# EasyEDA Pro project OpenTenkiEasyEda.eprj

# Schematic Schematic1_1
Board Name: OpenTenki; Create Date: 2025-09-28; Page Name: P1; Project Name: WetherBudy_r; Schematic Name: Schematic1_1; Update Date: 2026-03-23; Company: EasyEDA.com; Page Size: A4; Version: V1.0
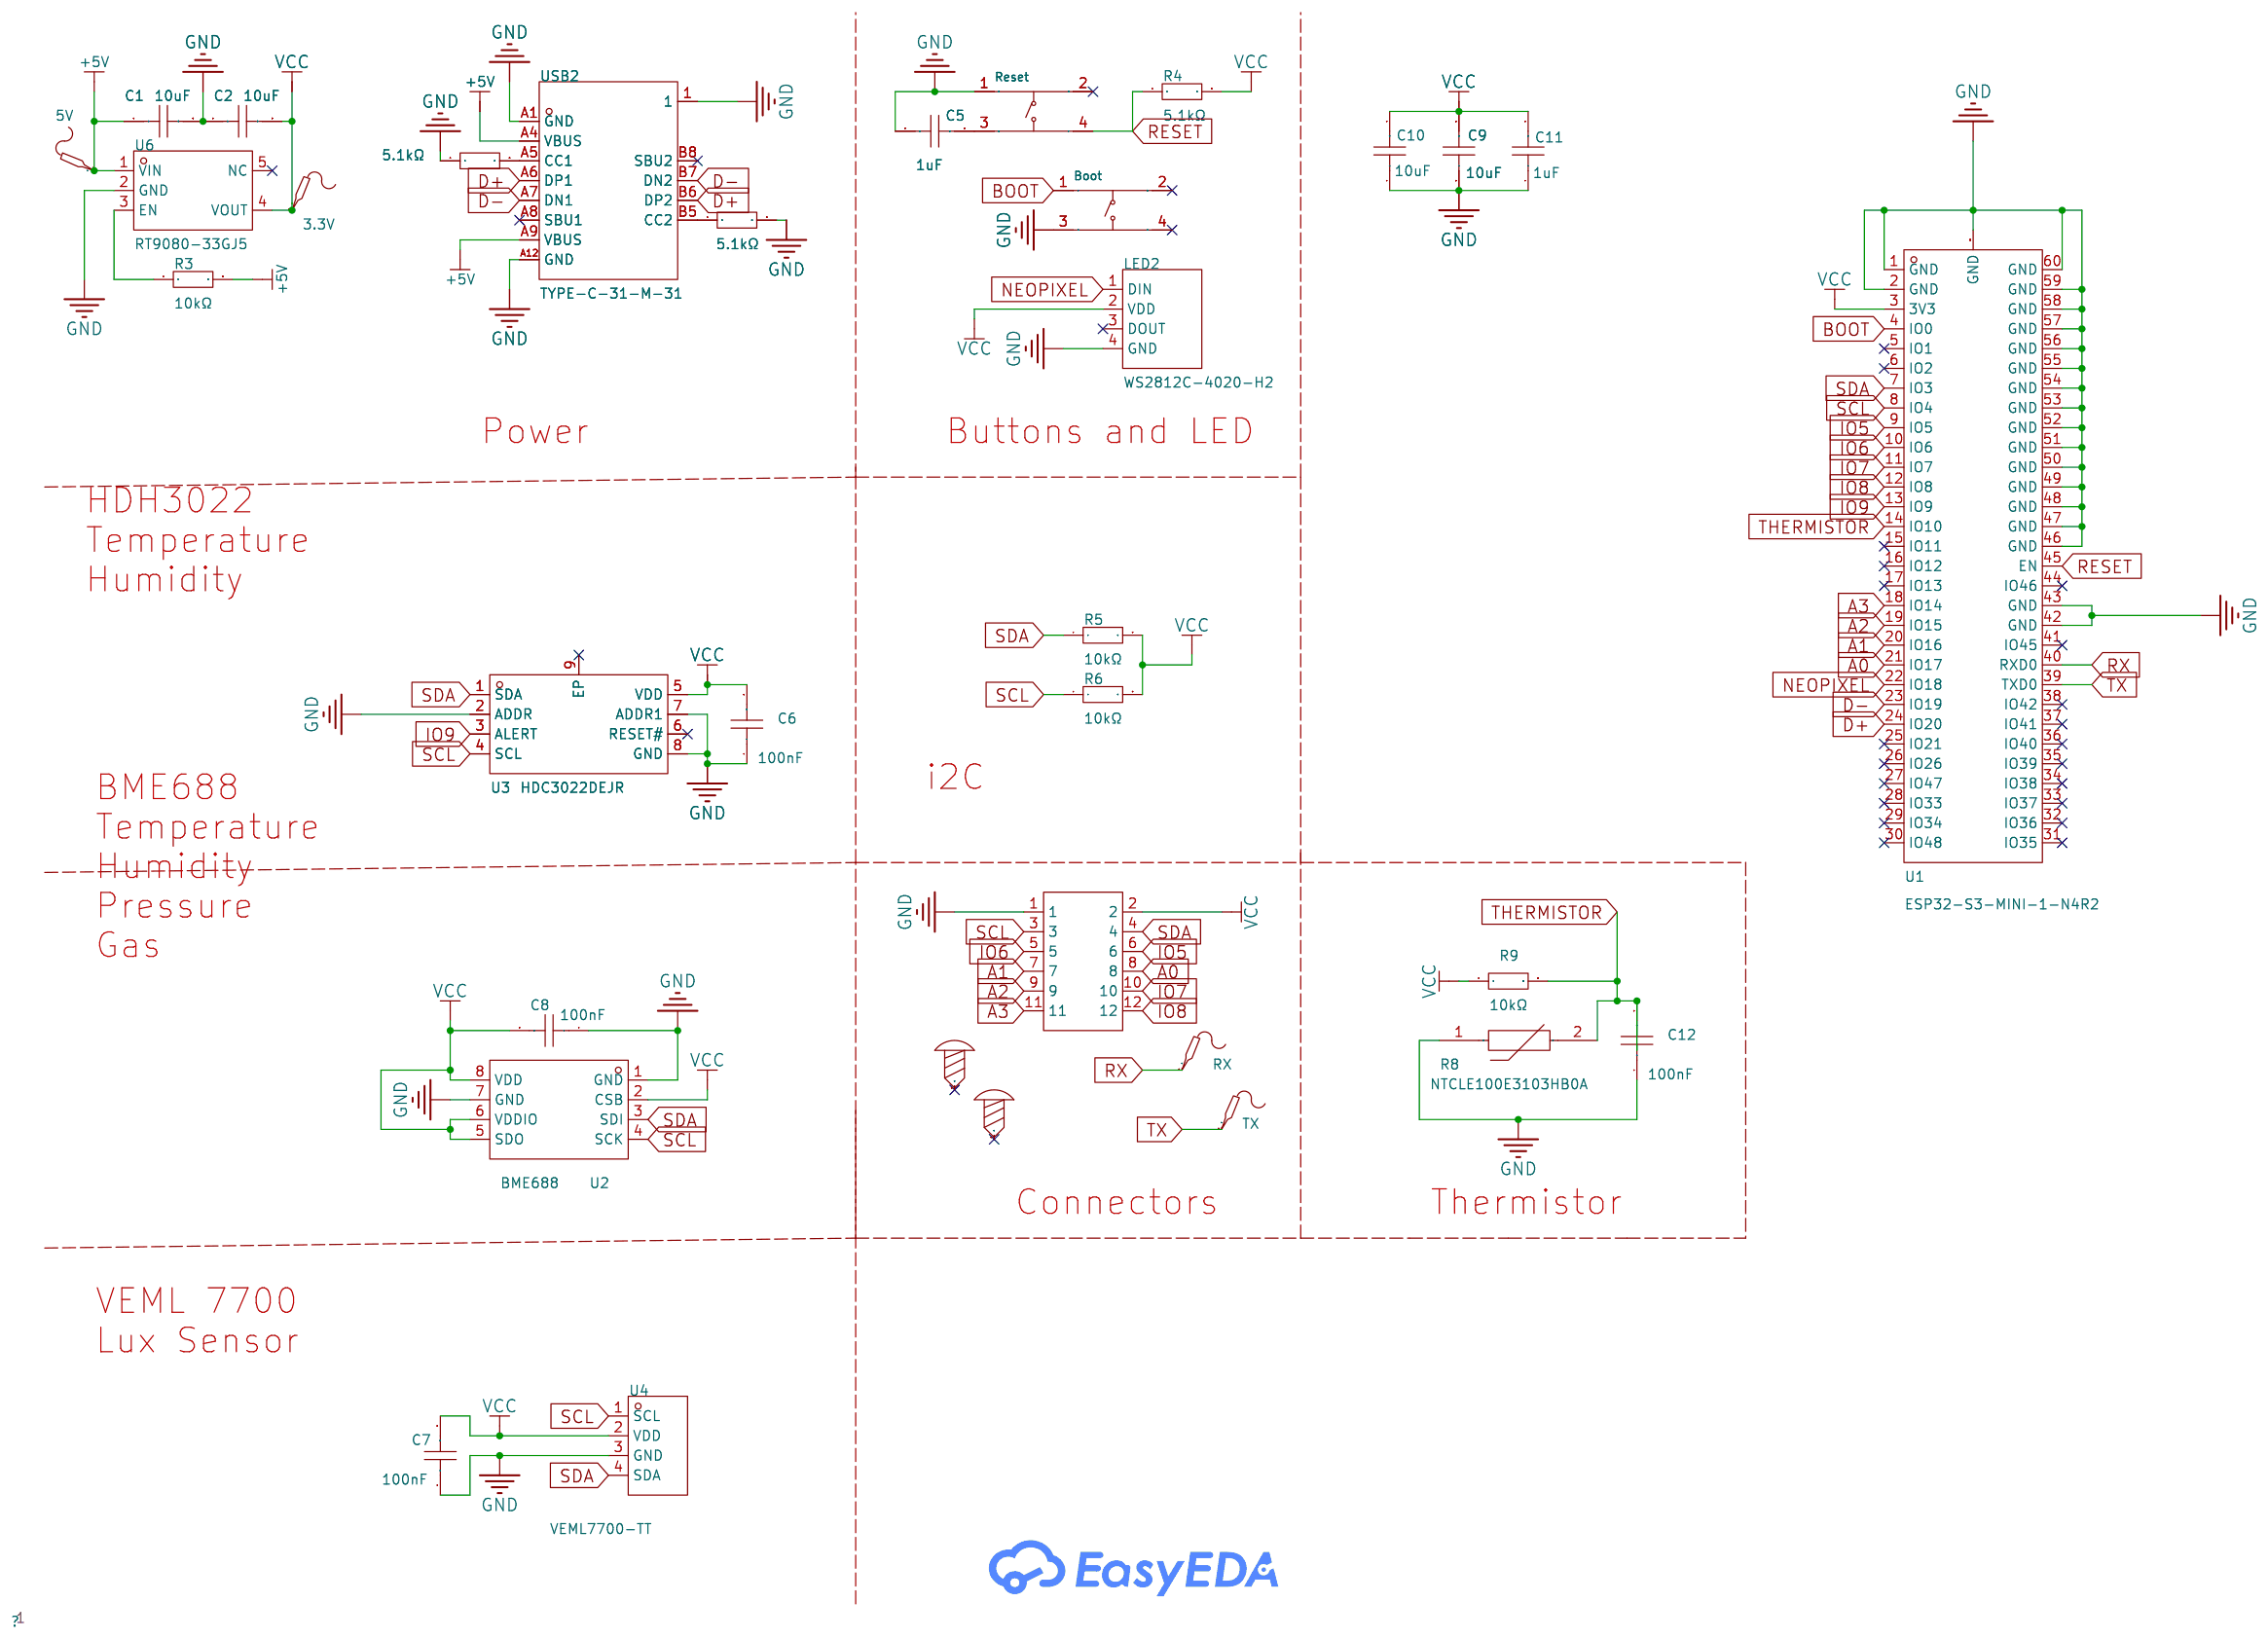
[diagram p0: schematic sheet]

## Parts
3.3V  -  [Test-Point-0.5mm]
5V  -  [Test-Point-0.5mm]
Boot  TSD4A 250gf-DZ  [SW-SMD_TSD4A]
C1  10uF  [C0603]
C2  10uF  [C0603]
C5  1uF  [C0603]
C6  100nF  [C0603]
C7  100nF  [C0603]
C8  100nF  [C0603]
C9  10uF  [C0603]
C10  10uF  [C0603]
C11  1uF  [C0603]
C12  100nF  [C0603]
LED2  WS2812C-4020-H2  [LED-SMD_4P-L4.0-W1.7_DCS-CA4020A0R02G02B02CE004]
R3  10kΩ  [R0603]
R4  5.1kΩ  [R0603]
R5  10kΩ  [R0603]
R6  10kΩ  [R0603]
R8  NTCLE100E3103HB0A  [RES-TH_L6.0-W3.0-P2.54-D0.6]
R9  10kΩ  [R0603]
R10  5.1kΩ  [R0603]
R11  5.1kΩ  [R0603]
Reset  TSD4A 250gf-DZ  [SW-SMD_TSD4A]
RX  -  [Test-Point-0.5mm]
SCREW2  -  [Screw-Hole-M2]
SCREW4  -  [Screw-Hole-M2]
TX  -  [Test-Point-0.5mm]
U1  ESP32-S3-MINI-1-N4R2  [BULETM-SMD_ESP32-S3-MINI-1-N8]
U2  BME688  [LGA-8_L3.0-W3.0-P0.80_BME688]
U3  HDC3022DEJR  [TDFN-8_L2.5-W2.5-P0.50-BL-EP]
U4  VEML7700-TT  [SENSOR-SMD_EML7700-TT]
U6  RT9080-33GJ5  [SOT-23-5_L3.0-W1.5-P0.95-LS2.8-BL]
U10  ZX-PZ2.54-2-6PZZ  [HDR-TH_12P-P2.54-V-M-R2-C6-S2.54]
USB2  TYPE-C-31-M-31  [USB-C-SMD_TYPE-C-31-M-31]

## Library data of the parts
3.3V 5V RX TX = Test-Point: Test Point 测试点
Boot Reset = TSD4A 250gf-DZ: Circuit:SPST Actuator Style:Rectangle button Mounting Style:卧贴 Switch Length:4.7mm Switch Width:4.5mm Switch Height:1.6mm Contact Current:50mA Voltage Rating (DC):12V With Lamp:- Mechanical Life:-; LCSC Part Name: 4.7*4.5*1.6mm 卧贴 轻触开关; Supplier Part: C431531; Manufacturer: SHOU HAN(首韩); Supplier Footprint: SMD,3.5x4.7mm; JLCPCB Part Class: Extended Part; Datasheet: https://atta.szlcsc.com/upload/public/pdf/source/20190925/C431531_0900C3010D7F342754DB2882E2E37F05.pdf; Supplier: LCSC; Circuit: SPST; Actuator Style: Rectangle button; Mounting Style: 卧贴; Switch Length: 4.7mm; Switch Width: 4.5mm; Switch Height: 1.6mm; Contact Current: 50mA; Voltage Rating (DC): 12V
C1 C2 C9 C10 = CL10A106KP8NNNC: Capacitance: Tolerance:±10% Tolerance:±10% Voltage Rated: Temperature Coefficient:; LCSC Part Name: 10uF ±10% 10V; Supplier Part: C19702; Manufacturer: SAMSUNG(三星); Supplier Footprint: 0603; JLCPCB Part Class: Basic Part; Datasheet: https://atta.szlcsc.com/upload/public/pdf/source/20160218/1457707763339.pdf; Supplier: LCSC; Tolerance: ±10%
C5 C11 = CL10A105KB8NNNC: Capacitance: Tolerance:±10% Tolerance:±10% Voltage Rated: Temperature Coefficient:; LCSC Part Name: 1uF ±10% 50V; Supplier Part: C15849; Manufacturer: SAMSUNG(三星); Supplier Footprint: 0603; JLCPCB Part Class: Basic Part; Datasheet: https://atta.szlcsc.com/upload/public/pdf/source/20160218/1457707763339.pdf; Supplier: LCSC; Tolerance: ±10%
C6-C8 C12 = CC0603KRX7R9BB104: Capacitance:100nF Tolerance:±10% Tolerance:±10% Voltage Rating:50V Temperature Coefficient:X7R; LCSC Part Name: 100nF ±10% 50V; Supplier Part: C14663; Manufacturer: YAGEO(国巨); Supplier Footprint: 0603; JLCPCB Part Class: Basic Part; Datasheet: https://atta.szlcsc.com/upload/public/pdf/source/20250214/096C4C206003071F5D32E5F0D8E7F8DF.pdf; Supplier: LCSC; Tolerance: ±10%; Voltage Rating: 50V; Temperature Coefficient: X7R
LED2 = WS2812C-4020-H2: Supplier Part: C42417604; Manufacturer: worldsemi; Supplier Footprint: SMD4020; JLCPCB Part Class: Extended Part; Datasheet: https://item.szlcsc.com/datasheet/WS2812C-4020-H2/44423164.html; Supplier: LCSC
R3 R5 R6 R9 = RC0603FR-0710KL: Type:Thick Film Resistors Resistance: Tolerance:±1% Tolerance:±1% Power(Watts): Overload Voltage (Max): Temperature Coefficient:±100ppm/℃ Temperature Coefficient:±100ppm/℃ Operating Temperature Range:-55℃~+155℃ Operating Temperature Range:-55℃~+155℃; LCSC Part Name: 厚膜电阻 10kΩ ±1% 100mW; Supplier Part: C98220; Manufacturer: YAGEO(国巨); Supplier Footprint: 0603; JLCPCB Part Class: Extended Part; Datasheet: https://atta.szlcsc.com/upload/public/pdf/source/20180927/C295883_E8D83085EA81BD7DE0B2B681138C15EE.pdf; Supplier: LCSC; Type: Thick Film Resistors; Tolerance: ±1%; Temperature Coefficient: ±100ppm/℃; Operating Temperature Range: -55℃~+155℃
R4 R10 R11 = RC0603FR-075K1L: Type:Thick Film Resistors Resistance:5.1kΩ Tolerance:±1% Tolerance:±1% Power(Watts):100mW Voltage-Supply(Max):75V Temperature Coefficient:±100ppm/℃ Temperature Coefficient:±100ppm/℃ Operating Temperature:-55℃~+155℃ Operating Temperature:-55℃~+155℃; LCSC Part Name: 厚膜电阻 5.1kΩ ±1% 100mW; Supplier Part: C105580; Manufacturer: YAGEO(国巨); Supplier Footprint: 0603; JLCPCB Part Class: Extended Part; Datasheet: https://atta.szlcsc.com/upload/public/pdf/source/20180316/70C0E2BDAE7FCC62C531A5A58D202EE1.pdf; Supplier: LCSC; Type: Thick Film Resistors; Tolerance: ±1%; Power(Watts): 100mW; Voltage-Supply(Max): 75V; Temperature Coefficient: ±100ppm/℃; Operating Temperature: -55℃~+155℃
R8 = NTCLE100E3103HT1: Resistance @ 25℃:10kΩ B Constant (25℃/50℃):- B Constant (25℃/75℃):- B Constant (25℃/85℃):3977K B Constant (25℃/100℃):- Power(Watts):500mW B Constant Tolerance:±0.75% Steady State Current (Max):- Operating Temperature:-40℃~+125℃ Operating Temperature:-40℃~; LCSC Part Name: 径向引脚式NTC热敏电阻; Supplier Part: C3153241; Manufacturer: VISHAY(威世); Supplier Footprint: 插件,P=2.54mm; JLCPCB Part Class: Extended Part; Datasheet: https://item.szlcsc.com/datasheet/NTCLE100E3103HT1/156627.html; Supplier: LCSC; Resistance @ 25℃: 10kΩ; B Constant (25℃/85℃): 3977K; Power(Watts): 500mW; B Constant Tolerance: ±0.75%; Operating Temperature: -40℃~+125℃
SCREW2 SCREW4 = Screw-Hole-M2: Supplier Footprint: 插件
U1 = ESP32-S3-MINI-1-N4R2: Antenna Type:On-Board PCB Antenna; Supplier Part: C3013941; Manufacturer: ESPRESSIF(乐鑫); Supplier Footprint: SMD; JLCPCB Part Class: Extended Part; Supplier: LCSC; Antenna Type: On-Board PCB Antenna
U2 = BME688_C3664478: Supplier Part: C3664478; Manufacturer: Bosch(博世); Supplier Footprint: SMD-8P; JLCPCB Part Class: Extended Part; Datasheet: https://atta.szlcsc.com/upload/public/pdf/source/20231017/7B3D7968BB5F8FA300E4D9B7C8303659.pdf; Supplier: LCSC
U3 = HDC3022DEJR: Supply Voltage:1.62V~5.5V Supply Voltage:1.62V~5.5V; Supplier Part: C17434731; Manufacturer: TI(德州仪器); Supplier Footprint: WSON-8(2.5x2.5); JLCPCB Part Class: Extended Part; Datasheet: https://atta.szlcsc.com/upload/public/pdf/source/20230922/E2A851A59393DDB09DDB78DA9755E936.pdf; Supplier: LCSC; Supply Voltage: 1.62V~5.5V
U4 = VEML7700-TT: Supply Voltage:2.5V~3.6V Supply Voltage:2.5V~3.6V Operating Temperature:-25℃~+85℃ Operating Temperature:-25℃~+85℃; LCSC Part Name: VEML7700 TT; Supplier Part: C1850416; Manufacturer: VISHAY(威世); Supplier Footprint: SMD-4P; JLCPCB Part Class: Extended Part; Datasheet: https://atta.szlcsc.com/upload/public/pdf/source/20210427/33543220A77474D84AA8ADAB59D35BD6.pdf; Supplier: LCSC; Supply Voltage: 2.5V~3.6V; Operating Temperature: -25℃~+85℃
U6 = RT9080-33GJ5_C20617299: Output Type:Fixed Voltage - Supply:5.5V Output Voltage:3.3V Output Voltage:3.3V Output Current:1100mA Power Supply Rejection Ratio (PSRR):- Operating Temperature:-40℃~+85℃@(Ta) Operating Temperature:-40℃~+85℃@(Ta) Output Configuration:Positive electrode N; LCSC Part Name: 线性稳压器(LDO); Supplier Part: C20617299; Manufacturer: TECH PUBLIC(台舟); Supplier Footprint: SOT-23-5; JLCPCB Part Class: Extended Part; Datasheet: https://atta.szlcsc.com/upload/public/pdf/source/20240202/7D431FA9A50F9981984D03C9A0172C67.pdf; Supplier: LCSC; Output Type: Fixed; Voltage - Supply: 5.5V; Output Voltage: 3.3V; Output Current: 1100mA; Operating Temperature: -40℃~+85℃@(Ta); Output Configuration: Positive electrode; Number of Outputs: 1
U10 = ZX-PZ2.54-2-6PZZ: Pin Structure:2x6P Pitch:2.54mm Row Spacing:2.54mm Circluar Pins/Square Pins:Policy Mounting Type:Straight Number of Rows:Double Row Number of Pins:12P Current Rating:3A Voltage Rating (Max):1kV Length of Mating Pin:6mm Insulation Height:2.5mm Length of E; LCSC Part Name: 2x6P 间距:2.54mm 方针 直插; Supplier Part: C7501277; Manufacturer: Megastar(兆星); Supplier Footprint: 插件,P=2.54mm; JLCPCB Part Class: Extended Part; Datasheet: https://atta.szlcsc.com/upload/public/pdf/source/20231122/7E8446F7D73762EB4E85E59BCD5E7B5B.pdf; Supplier: LCSC; Pin Structure: 2x6P; Pitch: 2.54mm; Row Spacing: 2.54mm; Circluar Pins/Square Pins: Policy; Mounting Type: Straight; Number of Rows: Double Row; Number of Pins: 12P; Current Rating: 3A; Voltage Rating (Max): 1kV; Length of Mating Pin: 6mm; Insulation Height: 2.5mm; Length of End Connection Pin: 3mm; Contact Material: Brass; Contact Plating: Gold; Operating Temperature: -40℃~+105℃; Color: Black
USB2 = TYPE-C-31-M-31: Connector Type:Type-C Protocol Standard:- Gender:Female Mounting Type:Surface Mount, Right Angle Number of Contacts:16P Number of Ports:1 Current Rating-Power:5A Voltage Rating:20V Connect-Disconnect Life:10,000 cycles Length:7.35mm Operating Temperature:; LCSC Part Name: Type-C 母 卧贴; Supplier Part: C2760486; Manufacturer: 韩国韩荣; Supplier Footprint: SMD; JLCPCB Part Class: Extended Part; Datasheet: https://item.szlcsc.com/datasheet/TYPE-C-31-M-31/2881626.html; Supplier: LCSC; Connector Type: Type-C; Gender: Female; Mounting Type: Surface Mount, Right Angle; Number of Contacts: 16P; Number of Ports: 1; Current Rating-Power: 5A; Voltage Rating: 20V; Connect-Disconnect Life: 10,000 cycles; Length: 7.35mm; Operating Temperature: -30℃~+80℃

## Nets
+5V: 5V.1 C1.1 R3.2 U6.1(VIN) USB2.A4(VBUS) USB2.A9(VBUS)
GND: Boot.3 C1.2 C2.1 C5.1 C6.1 C7.1 C8.1 C9.1 C10.1 C11.1 C12.1 LED2.4(GND) R8.1 R10.2 R11.1 Reset.1 U1.1(GND) U1.2(GND) U1.42(GND) U1.43(GND) U1.46(GND) U1.47(GND) U1.48(GND) U1.49(GND) U1.50(GND) U1.51(GND) U1.52(GND) U1.53(GND) U1.54(GND) U1.55(GND) U1.56(GND) U1.57(GND) U1.58(GND) U1.59(GND) U1.60(GND) U1.GND U2.1(GND) U2.7(GND) U3.2(ADDR) U3.7(ADDR1) U3.8(GND) U4.3(GND) U6.2(GND) U10.1 USB2.1 USB2.A1(GND) USB2.A12(GND)
VCC: 3.3V.1 C2.2 C6.2 C7.2 C8.2 C9.2 C10.2 C11.2 LED2.2(VDD) R4.2 R5.2 R6.2 R9.1 U1.3(3V3) U2.2(CSB) U2.5(SDO) U2.6(VDDIO) U2.8(VDD) U3.5(VDD) U4.2(VDD) U6.4(VOUT) U10.2
A0: U1.21(IO17) U10.8
A1: U1.20(IO16) U10.7
A2: U1.19(IO15) U10.9
A3: U1.18(IO14) U10.11
BOOT: Boot.1 U1.4(IO0)
D+: U1.24(IO20) USB2.A6(DP1) USB2.B6(DP2)
D-: U1.23(IO19) USB2.A7(DN1) USB2.B7(DN2)
IO5: U1.9(IO5) U10.6
IO6: U1.10(IO6) U10.5
IO7: U1.11(IO7) U10.10
IO8: U1.12(IO8) U10.12
IO9: U1.13(IO9) U3.3(ALERT)
NEOPIXEL: LED2.1(DIN) U1.22(IO18)
RESET: R4.1 Reset.4 U1.45(EN)
RX: RX.1 U1.40(RXD0)
SCL: R6.1 U1.8(IO4) U2.4(SCK) U3.4(SCL) U4.1(SCL) U10.3
SDA: R5.1 U1.7(IO3) U2.3(SDI) U3.1(SDA) U4.4(SDA) U10.4
THERMISTOR: C12.2 R8.2 R9.2 U1.14(IO10)
TX: TX.1 U1.39(TXD0)
$1N3242: R3.1 U6.3(EN)
$1N3926: C5.2 Reset.3
$1N16983: R10.1 USB2.B5(CC2)
$1N17042: R11.2 USB2.A5(CC1)

Not connected (* = marked no-connect by the designer): Boot 2* 4*; LED2 3(DOUT)*; Reset 2*; SCREW2 1*; SCREW4 1*; U1 5(IO1)* 6(IO2)* 15(IO11)* 16(IO12)* 17(IO13)* 25(IO21)* 26(IO26)* 27(IO47)* 28(IO33)* 29(IO34)* 30(IO48)* 31(IO35)* 32(IO36)* 33(IO37)* 34(IO38)* 35(IO39)* 36(IO40)* 37(IO41)* 38(IO42)* 41(IO45)* 44(IO46)*; U3 6(RESET#)* 9(EP)*; U6 5(NC)*; USB2 A8(SBU1)* B8(SBU2)*

## Notes on the sheet
- Power
- Buttons and LED
- HDH3022
  Temperature
  Humidity
- i2C
- BME688
  Temperature
  Humidity
  Pressure
  Gas
- Connectors
- Thermistor
- VEML 7700
  Lux Sensor

# Board PCB2
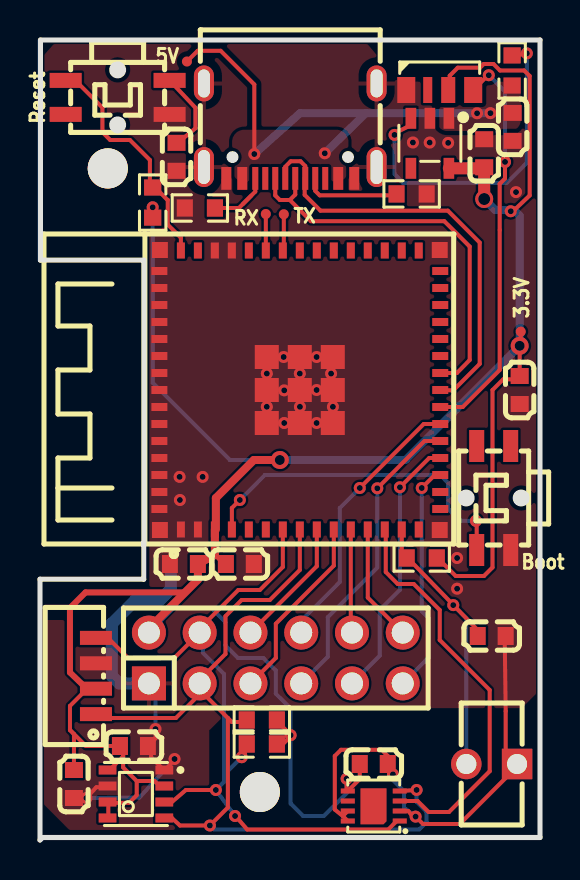
[diagram p1: board, top side]
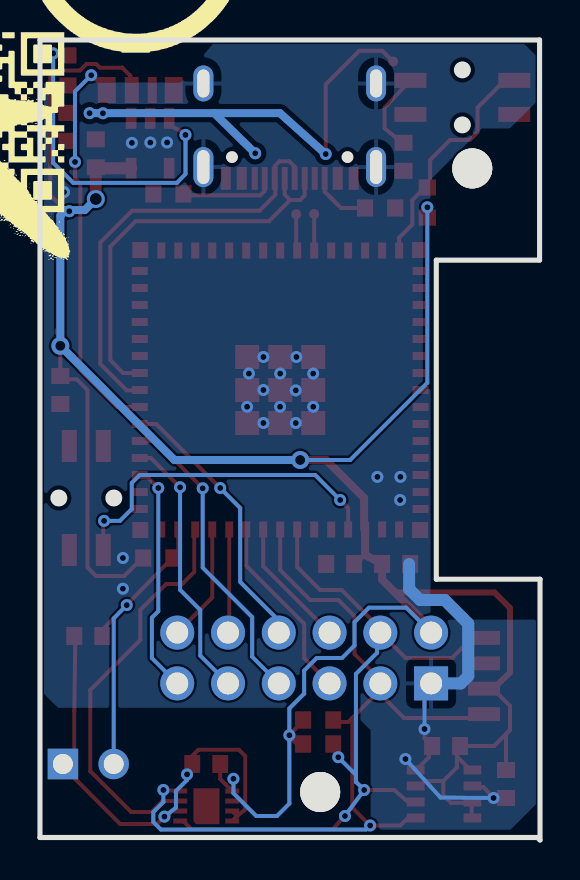
[diagram p2: board, bottom side, seen from below]

Outline 25.02 x 40 mm; copper layers: Top Layer, Bottom Layer. Coordinates in mm from the lower left corner of the outline.
Outline path: 0,13.04 5.19,13.04 5.19,28.99 0.02,28.99 0.02,40 25.02,40 25.02,0.12 0.12,0.12 0,0 0,13.04
Stack: Top Layer 0.035mm / Dielectric1 1.51mm FR4 er 4.5 / Bottom Layer 0.035mm

## Design rules (mm)
template: Custom Config
spacing copperThickness1oz (default): track to track 0.102, other pairs 0.152 to 0.3
spacing copperThickness2oz: track to track 0.203, other pairs 0.152 to 0.3
track width copperThickness1oz (default): min 0.16, default 0.2, max 2.54
track width copperThickness2oz: min 0.203, default 0.254, max 2.54
differential pair differentialPair (default): width min 0.127, default 0.2, max 2.54; gap min 0.152, default 0.152
via viaSize (default): diameter min 0.5, default 0.61, max 10; hole min 0.3, default 0.305, max 6.3
net +5V uses copperRegion1
pour e39 uses copperRegion2

## Placement (name value [footprint] x y rotation side)
3.3V  -  [Test-Point-0.5mm]  24.05 25.42 0 top
5V  -  [Test-Point-0.5mm]  7.35 38.92 0 top
Boot  TSD4A 250gf-DZ  [SW-SMD_TSD4A]  22.7 17.1 90 top
C1  10uF  [C0603]  23.65 35.66 270 top
C2  10uF  [C0603]  22.22 34.34 270 top
C5  1uF  [C0603]  6.83 34.16 90 top
C6  100nF  [C0603]  16.7 3.8 180 top
C7  100nF  [C0603]  1.7 2.8 90 top
C8  100nF  [C0603]  4.7 4.7 180 top
C9  10uF  [C0603]  24 22.5 90 top
C10  10uF  [C0603]  7.2 13.8 0 top
C11  1uF  [C0603]  10 13.8 180 top
C12  100nF  [C0603]  22.6 10.2 180 top
LED2  WS2812C-4020-H2  [LED-SMD_4P-L4.0-W1.7_DCS-CA4020A0R02G02B02CE004]  20 37.5 180 top
R3  10kΩ  [R0603]  23.62 38.48 270 top
R4  5.1kΩ  [R0603]  5.64 31.87 270 top
R5  10kΩ  [R0603]  11.1 4.8 0 top
R6  10kΩ  [R0603]  11.1 6 0 top
R8  NTCLE100E3103HB0A  [RES-TH_L6.0-W3.0-P2.54-D0.6]  22.6 3.8 180 top
R9  10kΩ  [R0603]  19.1 14.1 180 top
R10  5.1kΩ  [R0603]  8 31.6 180 top
R11  5.1kΩ  [R0603]  18.59 32.3 180 top
Reset  TSD4A 250gf-DZ  [SW-SMD_TSD4A]  3.89 37.13 180 top
RX  -  [Test-Point-0.5mm]  11.3 31.3 0 top
SCREW2  -  [Screw-Hole-M2]  11 2.4 0 top
SCREW4  -  [Screw-Hole-M2]  3.39 33.58 0 top
TX  -  [Test-Point-0.5mm]  12.2 31.29 0 top
U1  ESP32-S3-MINI-1-N4R2  [BULETM-SMD_ESP32-S3-MINI-1-N8]  13 22.5 90 top
U2  BME688  [LGA-8_L3.0-W3.0-P0.80_BME688]  4.8 2.3 0 top
U3  HDC3022DEJR  [TDFN-8_L2.5-W2.5-P0.50-BL-EP]  16.7 1.7 90 top
U4  VEML7700-TT  [SENSOR-SMD_EML7700-TT]  2.8 8.2 90 top
U6  RT9080-33GJ5  [SOT-23-5_L3.0-W1.5-P0.95-LS2.8-BL]  19.51 34.83 180 top
U10  ZX-PZ2.54-2-6PZZ  [HDR-TH_12P-P2.54-V-M-R2-C6-S2.54]  11.8 9.1 0 top
USB2  TYPE-C-31-M-31  [USB-C-SMD_TYPE-C-31-M-31]  12.52 35.45 180 top

## Footprints (pads in the part's own frame, mm; a bottom-side part is the same pattern mirrored in y, then rotated)
BULETM-SMD_ESP32-S3-MINI-1-N8
  rect 0.8x0.4 smd: 1(-6.975,5.95) 2(-6.975,5.1) 3(-6.975,4.25) 4(-6.975,3.4) 5(-6.975,2.55) 6(-6.975,1.7) 7(-6.975,0.85) 8(-6.975,0) 9(-6.975,-0.85) 10(-6.975,-1.7) 11(-6.975,-2.55) 12(-6.975,-3.4) 13(-6.975,-4.25) 14(-6.975,-5.1) 15(-6.975,-5.95) 31(6.975,-5.95) 32(6.975,-5.1) 33(6.975,-4.25) 34(6.975,-3.4) 35(6.975,-2.55) 36(6.975,-1.7) 37(6.975,-0.85) 38(6.975,0) 39(6.975,0.85) 40(6.975,1.7) 41(6.975,2.55) 42(6.975,3.4) 43(6.975,4.25) 44(6.975,5.1) 45(6.975,5.95)
  rect 0.4x0.8 smd: 16(-5.95,-7.025) 17(-5.1,-7.025) 18(-4.25,-7.025) 19(-3.4,-7.025) 20(-2.55,-7.025) 21(-1.7,-7.025) 22(-0.85,-7.025) 23(0,-7.025) 24(0.85,-7.025) 25(1.7,-7.025) 26(2.55,-7.025) 27(3.4,-7.025) 28(4.25,-7.025) 29(5.1,-7.025) 30(5.95,-7.025) 46(5.95,7.025) 47(5.1,7.025) 48(4.25,7.025) 49(3.4,7.025) 50(2.55,7.025) 51(1.7,7.025) 52(0.85,7.025) 53(0,7.025) 54(-0.85,7.025) 55(-1.7,7.025) 56(-2.55,7.025) 57(-3.4,7.025) 58(-4.25,7.025) 59(-5.1,7.025) 60(-5.95,7.025)
  rect 0.8x0.8 smd: GND(-7,7) GND(-7,-7) GND(7,7) GND(7,-7)
  rect 1.2x1.2 smd: GND(-1.65,1.65) GND(-1.65,0) GND(-1.65,-1.65) GND(0,1.65) GND(0,0) GND(0,-1.65) GND(1.65,1.65) GND(1.65,0) GND(1.65,-1.65)
C0603
  rect 0.8x0.9 smd: 1(-0.7,0) 2(0.7,0)
HDR-TH_12P-P2.54-V-M-R2-C6-S2.54
  rect 1.7x1.7 hole 1.1: 1(-6.35,-1.27)
  round 1.7 hole 1.1: 2(-6.35,1.27) 3(-3.81,-1.27) 4(-3.81,1.27) 5(-1.27,-1.27) 6(-1.27,1.27) 7(1.27,-1.27) 8(1.27,1.27) 9(3.81,-1.27) 10(3.81,1.27) 11(6.35,-1.27) 12(6.35,1.27)
LED-SMD_4P-L4.0-W1.7_DCS-CA4020A0R02G02B02CE004
  rect 0.9x1.3 smd: 1(-1.675,0) 4(1.675,0)
  rect 0.7x1.3 smd: 2(-0.425,0)
  rect 0.45x1.3 smd: 3(0.6,0)
LGA-8_L3.0-W3.0-P0.80_BME688
  rect 0.889x0.448 smd: 1(1.419,1.2) 2(1.419,0.4) 3(1.419,-0.4) 4(1.419,-1.2) 5(-1.419,-1.2) 6(-1.419,-0.4) 7(-1.419,0.4) 8(-1.419,1.2)
R0603
  rect 0.806x0.864 smd: 1(-0.753,0) 2(0.753,0)
RES-TH_L6.0-W3.0-P2.54-D0.6
  rect 1.524x1.524 hole 1: 1(-1.27,0)
  round 1.524 hole 1: 2(1.27,0)
Screw-Hole-M2
  round 2 hole 2: 1(0,0)
SENSOR-SMD_EML7700-TT
  rect 0.7x1.6 smd: 1(-1.905,0) 2(-0.635,0) 3(0.635,0) 4(1.905,0)
SOT-23-5_L3.0-W1.5-P0.95-LS2.8-BL
  rect 0.532x1.045 smd: 1(-0.95,-1.25) 2(0,-1.25) 3(0.95,-1.25) 4(-0.95,1.25) 5(0.95,1.25)
SW-SMD_TSD4A
  rect 1.6x0.75 smd: 1(-2.6,0.85) 2(2.6,0.85) 3(-2.6,-0.85) 4(2.6,-0.85)
TDFN-8_L2.5-W2.5-P0.50-BL-EP
  rect 0.25x0.7 smd: 1(-0.75,-1.3) 2(-0.25,-1.3) 3(0.25,-1.3) 4(0.75,-1.3) 5(0.75,1.3) 6(0.25,1.3) 7(-0.25,1.3) 8(-0.75,1.3)
  custom 1.8x1.3 smd: 9(-0.015,0.013)
Test-Point-0.5mm
  round 0.5 smd: 1(0,0)
USB-C-SMD_TYPE-C-31-M-31
  oval 1x2 hole 0.6x1.7: 1(-4.32,1.806) 1(4.32,1.806)
  oval 1x1.8 hole 0.6x1.4: 1(-4.32,-2.374) 1(4.32,-2.374)
  rect 0.5x1.14 smd: A1(-3.2,2.373) A4(-2.4,2.373) A9(2.4,2.373) A12(3.2,2.373)
  rect 0.3x1.14 smd: A5(-1.25,2.373) A6(-0.25,2.373) A7(0.25,2.373) A8(1.25,2.374) B5(1.75,2.373) B6(0.75,2.373) B7(-0.75,2.373) B8(-1.75,2.374)

## Nets
As in the schematic.

Pads without a net: Boot 2 4; LED2 3; Reset 2; SCREW2 1; SCREW4 1; U1 5 6 15 16 17 25 26 27 28 29 30 31 32 33 34 35 36 37 38 41 44; U3 6 9; U6 5; USB2 A8 B8

## Via types
v1: diameter 0.6, hole 0.3, Top Layer to Bottom Layer, 50 vias
v2: diameter 0.9, hole 0.5, Top Layer to Bottom Layer, 2 vias
v3: diameter 0.9, hole 0.6, Top Layer to Bottom Layer, 1 via

## Routing (per net, layer and track width the routed paths; a pad name or vN(x,y) marks a point on that pad's centre or on a via; arc(x,y) is an arc through that point)
+5V: length 23.2
  Top Layer w0.2: 5V.1 7.89,39.46 9.04,39.46 10.72,37.78 v1(10.72,34.3)
  Bottom Layer w0.4: v1(10.72,34.3) 13.01,36.34 16.3,36.34 ; 16.3,36.34 v1(14.25,34.34) ; 16.3,36.34 v1(22.54,36.34)
  vias: v1(21.87,36.34)
GND: length 45.9
  Top Layer w0.2: v1(2.32,2.1) 2.82,2.64 3.42,2.64 ; C8.1 5.78,5.08 5.78,5.68 ; 5.56,4.8 5.56,4.14 6.26,3.44 ; 6.24,3.44 v1(6.73,4.05) ; 15.15,1.2 14.75,1.52 14.75,4.2 15.06,4.51 17.09,4.51 17.66,3.94 17.66,3.14 ; 15.15,1.2 U3.7 ; 15.15,1.2 U3.8 ; U3.2 18.42,1.45 18.61,1.22 v1(18.79,1.17) 19.16,0.8 21,0.8 23.3,3.1 23.3,6.45 23.25,10.2
  Bottom Layer w0.2: v1(2.32,2.1) 4.98,2.12 v1(6.73,4.05) ; v1(5.78,5.55) 5.78,7.46 ; v1(17.66,3.28) 17.66,3 18.21,2.45 18.21,1.62 v1(18.79,1.17)
  Bottom Layer w0.6: U10.1 3.96,7.83 3.59,8.2 3.59,10.82 4.77,12 6,12 6.55,12.55 6.55,13.8
  vias: v1(6.99,18.16) v1(7,17) v1(8.14,18.16) v1(11.35,23.32) v1(11.35,21.66) v1(12.19,24.15) v1(12.22,22.48) v1(12.22,20.85) v1(13,23.32) v1(13.01,21.66) v1(13.84,24.15) v1(13.84,22.5) v1(13.84,20.85) v1(14.56,23.32) v1(14.66,21.66) v1(18.66,34.88) v1(19.5,34.87) v1(20.42,34.86) v1(20.87,14.1) v1(20.87,12.56) v1(23.82,32.39)
VCC: length 133.7
  Top Layer w0.2: 1.5,5.5 1.5,6.7 2.11,7.31 ; 1.5,5.5 2.3,4.7 4.05,4.7 ; 1.5,5.5 1.7,5.3 C7.2 ; 3.42,1.04 3.42,1.84 3.44,1.86 4.46,1.86 4.84,2.24 4.84,2.95 ; 4.16,4.8 4.16,4.18 3.42,3.44 ; 4.16,4.49 4.16,3.63 4.84,2.95 ; 4.84,2.95 5.73,2.95 6.04,2.64 ; 8.75,14.25 9.2,13.8 C11.2 ; 11.79,5.9 11.9,5.9 12.54,5.26 ; 11.75,4.6 11.96,4.6 12.54,5.18 ; v1(15.34,3.06) 15.34,2.51 U3.5 16,3.05 C6.2 ; 19.75,14.1 19.9,14.1 20.8,13.2 22.21,13.2 22.64,13.63 22.64,22.5 23.17,23.03 24,23.03 ; 20.5,37.67 20.5,38.22 20.9,38.61 22.02,38.61 22.2,38.8 22.69,38.8 23.01,38.48 24.22,38.48 24.5,38.2 24.5,32.23 23.58,31.36 ; 24,23.15 v2(24,24.71) 24.05,24.76 24.05,25.37
  Top Layer w0.3: 2.34,7.56 1.5,8.38 1.5,11.6 2.28,12.38 7.2,12.38
  Top Layer w0.4: 5.65,10.77 7.9,13.02 C10.2 8.75,14.25 U1.3 ; 8.8,15.53 8.8,17.1 10.7,19 v2(12,19)
  Top Layer w0.6: U6.4 22.17,33.58 C2.2 v3(22.22,32.05)
  Bottom Layer w0.2: v1(5.64,31.64) 5.64,22.86 9.5,19 v2(12,19) ; U10.2 6.69,11.61 8.56,11.61 9.28,10.89 9.28,9.72 9.91,9.1 11.17,9.1 11.8,8.47 11.8,7.32 12.54,6.58 12.54,1.82 13.16,1.2 14.2,1.2 15.34,2.34 v1(15.34,3.06)
  Bottom Layer w0.4: v2(12,19) 18.29,19 v2(24,24.71) 24,31.22 23.72,31.5 22.78,31.5 v3(22.22,32.05)
  vias: v1(12.54,5.24) v1(23.55,31.44)
A0: length 13.6
  Top Layer w0.2: v1(16,17.6) 19.2,20.8 U1.21
  Bottom Layer w0.2: 12.77,10.67 15,12.9 15,16.6 v1(16,17.6)
A1: length 15.5
  Top Layer w0.2: v1(16.88,17.59) 19.24,19.95 U1.20
  Bottom Layer w0.2: U10.7 14.4,9.16 14.4,11.14 16.88,13.62 v1(16.88,17.59)
A2: length 13.4
  Top Layer w0.2: v1(18.01,17.64) 19.47,19.1 U1.19
  Bottom Layer w0.2: U10.9 17,9.22 17,11.5 18.01,12.51 v1(18.01,17.64)
A3: length 11.8
  Top Layer w0.2: 19,17.5 19.75,18.25 U1.18
  Bottom Layer w0.2: v1(19.1,17.6) 19.1,11.44 19.42,11.12 19.42,9.1 U10.11
BOOT: length 17.2
  Top Layer w0.2: U1.4 9.6,16.6 v1(10,17) ; v1(21.81,15.96) 21.85,15.92 Boot.1
  Bottom Layer w0.2: v1(10,17) 11.25,18.25 20.03,18.25 20.43,17.85 20.43,16.55 21.02,15.96 v1(21.81,15.96)
NEOPIXEL: length 20
  Top Layer w0.2: U1.22 21.15,21.65 23,23.5 23,32.81 23.27,33.08 v1(23.27,33.9) ; LED2.1 22.41,38.24 v1(22.45,38.24)
  Bottom Layer w0.2: v1(22.45,38.24) 23.27,37.43 v1(23.27,33.9)
SCL: length 41.4
  Top Layer w0.2: U4.1 3.4,6.1 6.8,6.1 7.99,7.29 U10.3 7.99,7.51 9.4,6.1 ; 6.3,1.1 6.6,1.1 7,0.72 v1(8.5,0.72) 9.4,1.62 9.4,6.1 ; 9.4,6.1 9.6,5.9 10.2,5.9 ; 8.19,8.23 8.21,8.23 9.28,9.3 9.28,11.19 10.09,12 11.5,12 13,13.5 U1.8 ; U3.4 18.08,2.45 v1(18.84,2.5)
  Bottom Layer w0.2: v1(8.5,0.72) 8.7,0.53 18.97,0.53 19.34,0.9 19.34,1.4 18.84,1.9 v1(18.84,2.5)
SDA: length 36.4
  Top Layer w0.2: 2.6,10.31 3.2,10.31 4.4,9.1 6.72,9.1 7.79,10.17 ; 6.6,1.9 7.3,2.5 v1(8.8,2.5) ; v1(9.76,1.2) 9.79,1.2 10.37,0.53 17.43,0.53 17.85,0.95 ; 8.19,10.77 9.92,12.5 11,12.5 12.15,13.65 U1.7 ; 10.25,4.6 10.25,4.29 v1(10.09,4.14)
  Bottom Layer w0.2: 8.15,10.37 8.15,9.36 9.21,8.3 9.21,2.91 ; 9.21,2.91 9.21,3.25 v1(10.09,4.14) ; 9.21,2.91 v1(8.8,2.5) v1(9.76,1.2) 9.79,1.2
THERMISTOR: length 14.8
  Top Layer w0.2: U1.14 18.1,14.1 18.4,14.1 21.8,10.6
  Bottom Layer w0.2: v1(20.68,11.74) 21.33,11.08 R8.2
$1N3242: length 16.4
  Top Layer w0.2: 17.64,35.28 18.53,35.73 18.55,35.75 ; 23.62,39.19 v1(24.36,39.33)
  Bottom Layer w0.2: v1(17.74,35.25) 17.74,33.3 18.16,32.86 23.36,32.86 24.36,33.86 v1(24.36,39.33)
D+: length 20.1
  Top Layer w0.2: 11.77,33 11.77,32.23 12,32 12.5,32 ; 12.5,32 12.77,32.27 12.77,33 ; 12.5,32 13.56,30.94 20.23,30.94 21.5,29.67 21.5,24 20.86,23.35 20.01,23.35
D-: length 21.5
  Top Layer w0.2: 12.27,33.12 12.27,33.66 12.55,33.94 13.03,33.94 13.27,33.7 USB2.B7 ; 13.24,33.1 13.24,32.26 14.03,31.47 20.41,31.47 22,29.87 22,23.81 20.68,22.48 20.04,22.49
IO5: length 6.5
  Top Layer w0.2: U1.9 13.85,13.69 U10.6
IO6: length 9.4
  Top Layer w0.2: U10.5 11.8,9.1 11.8,10.81 14.7,13.72 U1.10
IO7: length 5.2
  Top Layer w0.2: U1.11 15.55,10.43 U10.10
IO8: length 5.9
  Top Layer w0.2: U1.12 16.4,12.12 U10.12
IO9: length 20.3
  Top Layer w0.2: U1.13 17.3,15.47 17.3,13.4 17.9,12.8 18.7,12.8 20,11.5 20,10 22.5,7.5 22.5,3.44 20.46,1.4 19.44,1.4 18.89,1.95 U3.3
RESET: length 11.9
  Top Layer w0.2: Reset.4 1.77,37.98 3.12,36.62 3.12,35.39 3.51,35 4.5,35 5.5,34 5.5,32.59 5.8,32.59 6.38,32 6.39,32 6.39,30.77 7.05,30.11 U1.45
RX: length 1.8
  Top Layer w0.2: U1.40 RX.1
TX: length 1.8
  Top Layer w0.2: TX.1 12.2,29.52 U1.39
$1N3926: length 4.1
  Top Layer w0.2: Reset.3 7.78,36.61 7.78,35.59 6.83,34.81
$1N16983: length 3.5
  Top Layer w0.2: 8.79,31.6 9.95,31.6 10.57,32.22 ; 10.15,31.8 10.77,32.42 10.77,33
$1N17042: length 4.5
  Top Layer w0.2: 13.77,33 13.77,32.46 14,32.23 17.61,32.23

## Copper pours and planes (outline as drawn; the poured copper is in the pictures)
+5V on Top Layer: 19.88,37.36 19.9,37.47 19.95,37.6 20.03,37.71 20.15,37.8 20.28,37.85 20.38,37.86 23.5,37.86 23.61,37.85 23.74,37.8 23.85,37.71 23.94,37.6 23.99,37.47 24,37.36 24,36 23.99,35.89 23.94,35.76 23.85,35.65 23.74,35.56 23.61,35.51 23.5,35.5 20.38,35.5 20.28,35.51 20.15,35.56 20.03,35.65 19.95,35.76 19.9,35.89 19.88,36
+5V on Top Layer: 9.71,34.91 9.73,35.02 9.78,35.15 9.86,35.26 9.97,35.35 10.11,35.4 10.21,35.41 14.83,35.41 14.94,35.4 15.07,35.35 15.18,35.26 15.27,35.15 15.32,35.02 15.33,34.91 15.33,33.52 15.32,33.41 15.27,33.28 15.18,33.17 15.07,33.08 14.94,33.03 14.83,33.02 10.21,33.02 10.11,33.03 9.97,33.08 9.86,33.17 9.78,33.28 9.73,33.41 9.71,33.52
GND on Top Layer: 24.97,37.91 24.97,7.46 24.1,6.59 9.58,6.59 8.49,5.5 8.47,5.5 8.47,1 7.97,0.5 1.47,0.5 0,1.97 -0.03,1.97 -0.03,11 5.47,11 5.47,33 2.91,35.57 1.5,35.57 -0.03,37.1 -0.03,38.98 0.87,40 16.22,40 17.97,37.91
GND on Bottom Layer: -0.02,39 1,40.02 16.19,40.02 17.98,37.88 24.98,37.88 24.98,7.47 24.11,6.61 9.59,6.61 8.5,5.52 8.48,5.52 8.48,1.01 7.98,0.51 1.48,0.51 0.01,1.98 -0.02,1.98 -0.02,11.02 5.48,11.02 5.48,33.02 2.91,35.58 1.51,35.58 -0.02,37.12
